# EAGLE design minimumSystem_Gustina diah (EAGLE 7.1.0)
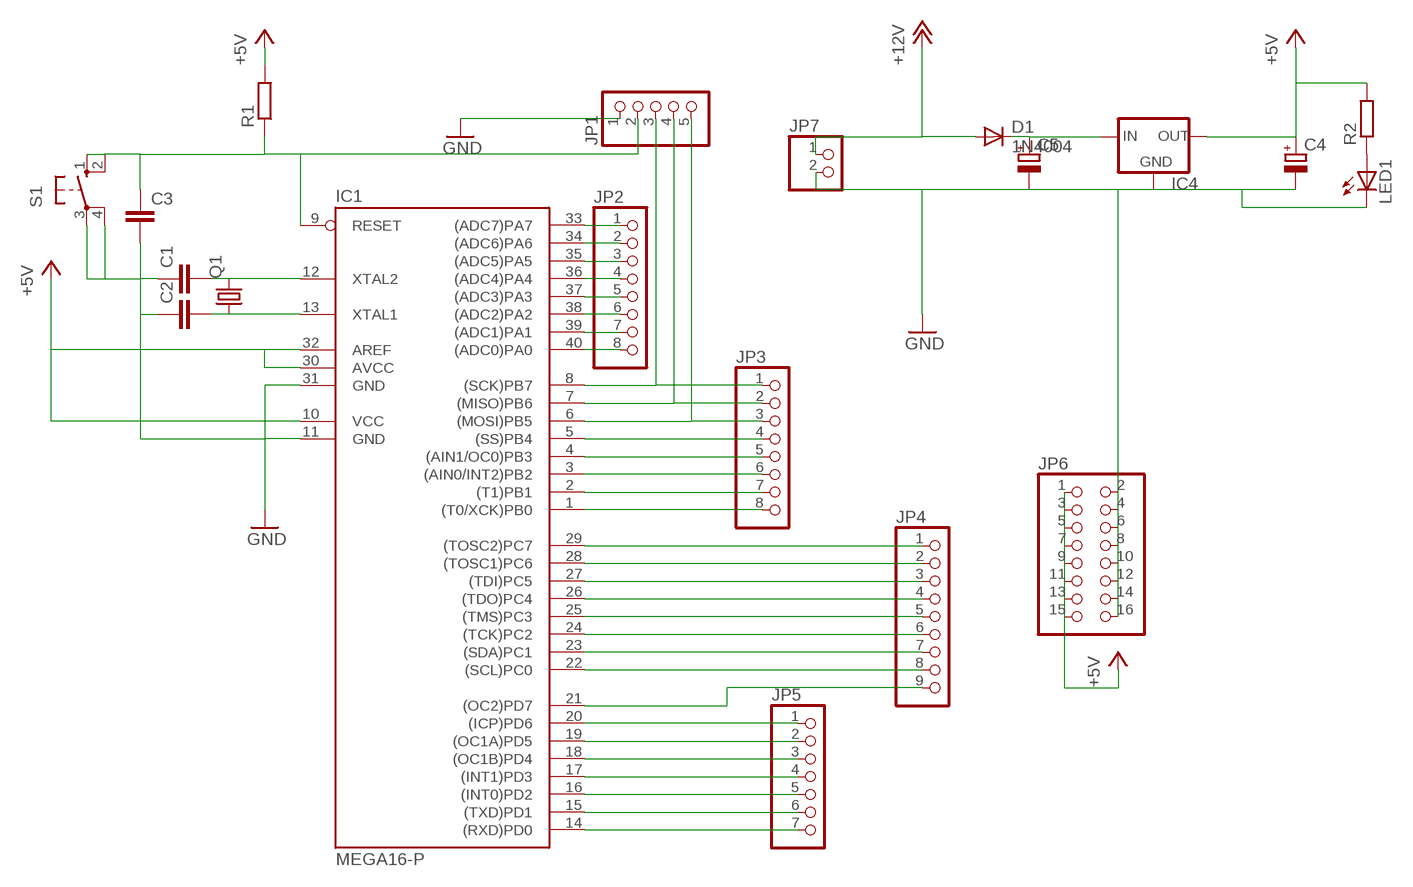
[diagram p0: schematic, sheet 1]

## Parts
C1  C-EU025-024X044  [C025-024X044]
C2  C-EU025-024X044  [C025-024X044]
C3  C-EU050-025X075  [C050-025X075]
C4  CPOL-EUE2.5-5  [E2,5-5]
C5  CPOL-EUE2.5-5  [E2,5-5]
D1  1N4004  [DO41-10]
IC1  MEGA16-P  [DIL40]
IC4  78XXS  [78XXS]
JP1  PINHD-1X5  [1X05]
JP2  PINHD-1X8  [1X08]
JP3  PINHD-1X8  [1X08]
JP4  PINHD-1X9  [1X09]
JP5  PINHD-1X7  [1X07]
JP6  PINHD-2X8  [2X08]
JP7  PINHD-1X2  [1X02]
LED1  LED5MM  [LED5MM]
Q1  CRYSTALHC49U-V  [HC49U-V]
R1  R-EU_0204/7  [0204/7]
R2  R-EU_0204/7  [0204/7]
S1  10-XX  [B3F-10XX]

## Nets
+5V: C4.+ IC1.10(VCC) IC1.30(AVCC) IC1.32(AREF) IC4.OUT JP6.1 JP6.3 JP6.5 JP6.7 JP6.9 JP6.11 JP6.13 JP6.15 R1.2 R2.2
+12V: D1.A JP7.1
C0: IC1.22((SCL)PC0) JP4.8
C1: IC1.23((SDA)PC1) JP4.7
C2: IC1.24((TCK)PC2) JP4.6
C3: IC1.25((TMS)PC3) JP4.5
D7: IC1.14((RXD)PD0) JP5.7
GND: C1.1 C2.1 C3.2 C4.- C5.- IC1.11(GND) IC1.31(GND) IC4.GND JP1.1 JP6.2 JP6.4 JP6.6 JP6.8 JP6.10 JP6.12 JP6.14 JP6.16 JP7.2 LED1.K(C) S1.3(P) S1.4(P1)
N$1: IC1.33((ADC7)PA7) JP2.1
N$2: IC1.34((ADC6)PA6) JP2.2
N$3: IC1.35((ADC5)PA5) JP2.3
N$4: IC1.36((ADC4)PA4) JP2.4
N$5: IC1.37((ADC3)PA3) JP2.5
N$6: IC1.38((ADC2)PA2) JP2.6
N$7: IC1.39((ADC1)PA1) JP2.7
N$8: IC1.40((ADC0)PA0) JP2.8
N$11: IC1.29((TOSC2)PC7) JP4.1
N$12: IC1.28((TOSC1)PC6) JP4.2
N$13: IC1.27((TDI)PC5) JP4.3
N$14: IC1.5((SS)PB4) JP3.4
N$15: IC1.20((ICP)PD6) JP5.1
N$16: IC1.19((OC1A)PD5) JP5.2
N$19: IC1.26((TDO)PC4) JP4.4
N$20: IC1.6((MOSI)PB5) JP1.5 JP3.3
N$21: IC1.4((AIN1/OC0)PB3) JP3.5
N$22: IC1.3((AIN0/INT2)PB2) JP3.6
N$23: IC1.2((T1)PB1) JP3.7
N$24: IC1.1((T0/XCK)PB0) JP3.8
N$25: C5.+ D1.C IC4.IN
N$30: IC1.15((TXD)PD1) JP5.6
N$31: IC1.16((INT0)PD2) JP5.5
N$32: IC1.17((INT1)PD3) JP5.4
N$33: C3.1 IC1.9(RESET) JP1.2 R1.1 S1.1(S) S1.2(S1)
N$34: IC1.18((OC1B)PD4) JP5.3
N$35: C1.2 IC1.12(XTAL2) Q1.2
N$36: C2.2 IC1.13(XTAL1) Q1.1
N$37: LED1.A R2.1
N$46: IC1.8((SCK)PB7) JP1.3 JP3.1
N$47: IC1.7((MISO)PB6) JP1.4 JP3.2
RS: IC1.21((OC2)PD7) JP4.9

## Library data of the parts
C1 C2 = rcl:C-EU: CAPACITOR, European symbol
C3 = resistor:C-EU: CAPACITOR, European symbol
C4 C5 = rcl:CPOL-EU: POLARIZED CAPACITOR, European symbol
D1 = diode:1N4004: DIODE general purpose rectifier, 1 A
IC1 = atmel:MEGA16-P: MICROCONTROLLER 16 Kbytes FLASH 1 kbytes SRAM 512 bytes EEPROM USART 8-channel 10 bit ADC Source: avr.lbr; MPN: ATMEGA16-16PU; OC_FARNELL: 9171142; OC_NEWARK: 01M6885
IC4 = v-reg:78XXS: VOLTAGE REGULATOR
JP1 = pinhead:PINHD-1X5: PIN HEADER
JP2 JP3 = pinhead:PINHD-1X8: PIN HEADER
JP4 = pinhead:PINHD-1X9: PIN HEADER
JP5 = pinhead:PINHD-1X7: PIN HEADER
JP6 = pinhead:PINHD-2X8: PIN HEADER
JP7 = pinhead:PINHD-1X2: PIN HEADER
LED1 = led:LED: LED OSRAM: - CHIPLED LG R971, LG N971, LY N971, LG Q971, LY Q971, LO R971, LY R971 LH N974, LH R974 LS Q976, LO Q976, LY Q976 LO Q996 - Hyper CHIPLED LW Q18S LB Q993, LB Q99A, LB R99A - SideLED LS A670, LO A670, LY A670, LG A670, LP A670 LB A673, LV A673, LT A673, LW A673 LH A674 LY A675 LS A676, LA A676, LO A676, LY A676, LW A676 LS A679, LY A679, LG A679 - Hyper Micro SIDELED® LS Y876, LA Y876, LO Y876, LY Y876 LT Y87S - SmartLED LW L88C, LW L88S LB L89C, LB L89S, LG L890 LS L89K, LO L89K, LY L89K LS L896, LA L896, LO L896, LY L896 - TOPLED LS T670, LO T670, LY T670, LG T670, LP T670 LSG T670, LSP T670, LSY T670, LOP T670, LYG T670 LG T671, LOG T671, LSG T671 LB T673, LV T673, LT T673, LW T673 LH T674 LS T676, LA T676, LO T676, LY T676, LB T676, LH T676, LSB T676, LW T676 LB T67C, LV T67C, LT T67C, LS T67K, LO T67K, LY T67K, LW E67C LS E67B, LA E67B, LO E67B, LY E67B, LB E67C, LV E67C, LT E67C LW T67C LS T679, LY T679, LG T679 LS T770, LO T770, LY T770, LG T770, LP T770 LB T773, LV T773, LT T773, LW T773 LH T774 LS E675, LA E675, LY E675, LS T675 LS T776, LA T776, LO T776, LY T776, LB T776 LHGB T686 LT T68C, LB T68C - Hyper Mini TOPLED® LB M676 - Mini TOPLED Santana® LG M470 LS M47K, LO M47K, LY M47K Source: http://www.osram.convergy.de LUXEON: - LUMILED® LXK2-PW12-R00, LXK2-PW12-S00, LXK2-PW14-U00, LXK2-PW14-V00 LXK2-PM12-R00, LXK2-PM12-S00, LXK2-PM14-U00 LXK2-PE12-Q00, LXK2-PE12-R00, LXK2-PE12-S00, LXK2-PE14-T00, LXK2-PE14-U00 LXK2-PB12-K00, LXK2-PB12-L00, LXK2-PB12-M00, LXK2-PB14-N00, LXK2-PB14-P00, LXK2-PB14-Q00 LXK2-PR12-L00, LXK2-PR12-M00, LXK2-PR14-Q00, LXK2-PR14-R00 LXK2-PD12-Q00, LXK2-PD12-R00, LXK2-PD12-S00 LXK2-PH12-R00, LXK2-PH12-S00 LXK2-PL12-P00, LXK2-PL12-Q00, LXK2-PL12-R00 Source: www.luxeon.com KINGBRIGHT: KA-3528ASYC Source: www.kingbright.com
Q1 = crystal:CRYSTAL: CRYSTAL; OC_FARNELL: 1666969; OC_NEWARK: unknown
R1 R2 = rcl:R-EU_: RESISTOR, European symbol
S1 = switch-omron:10-XX: OMRON SWITCH; MPN: B3F-1000; OC_FARNELL: 176432; OC_NEWARK: 36M3542

## Board
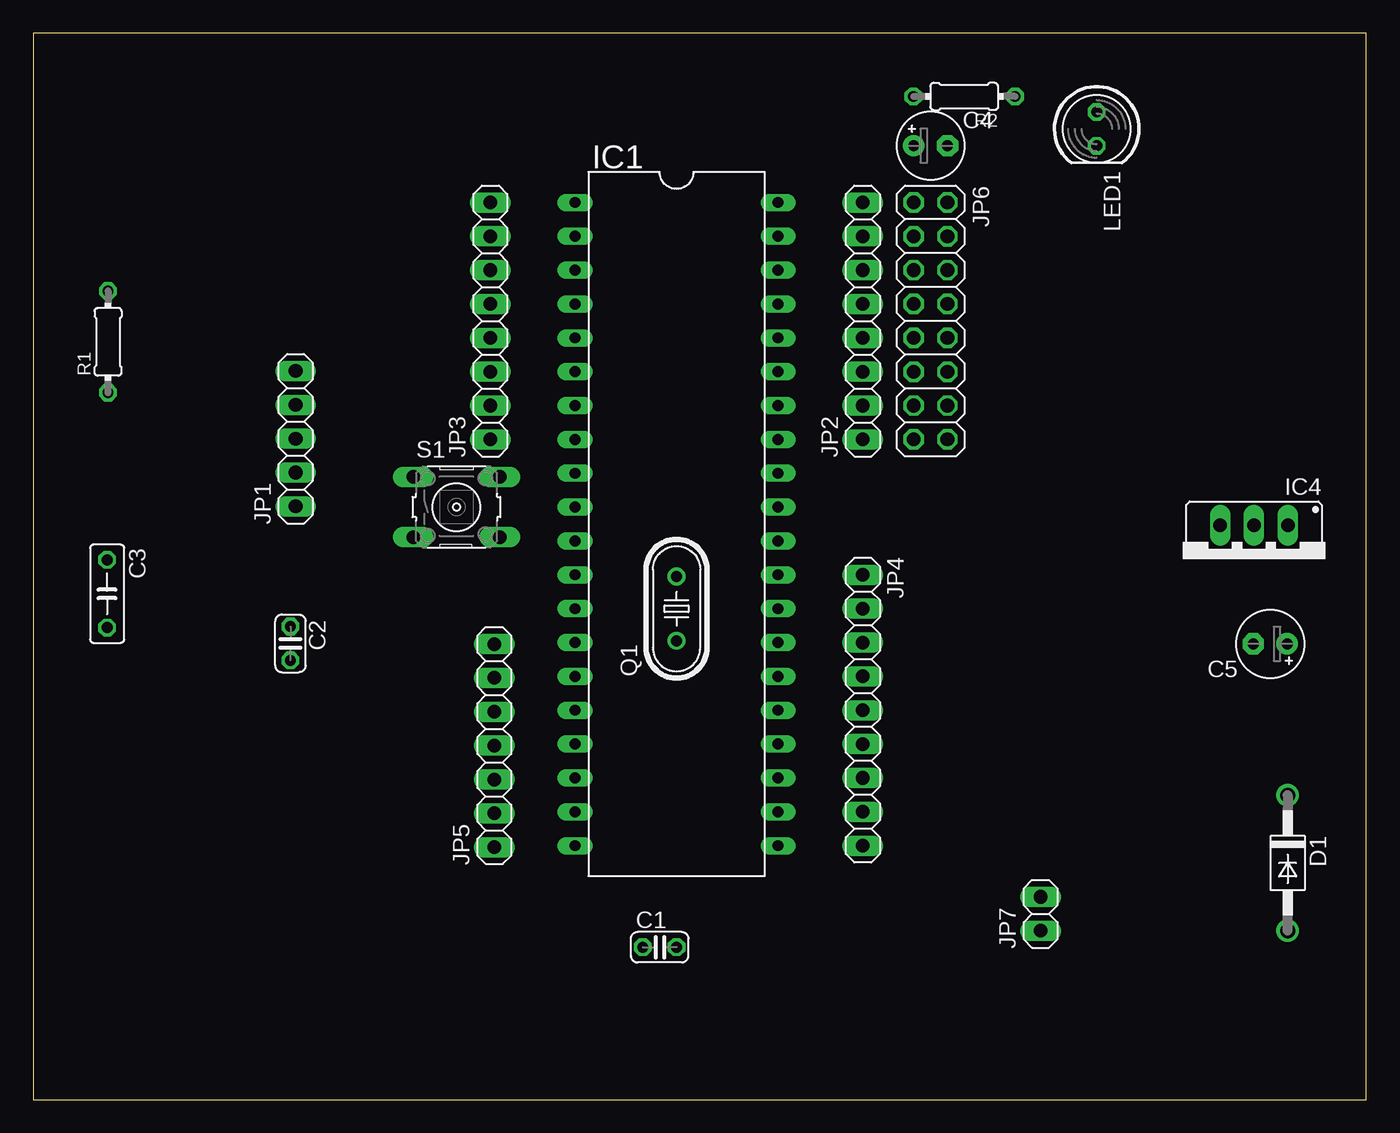
[diagram p1: board, top side]
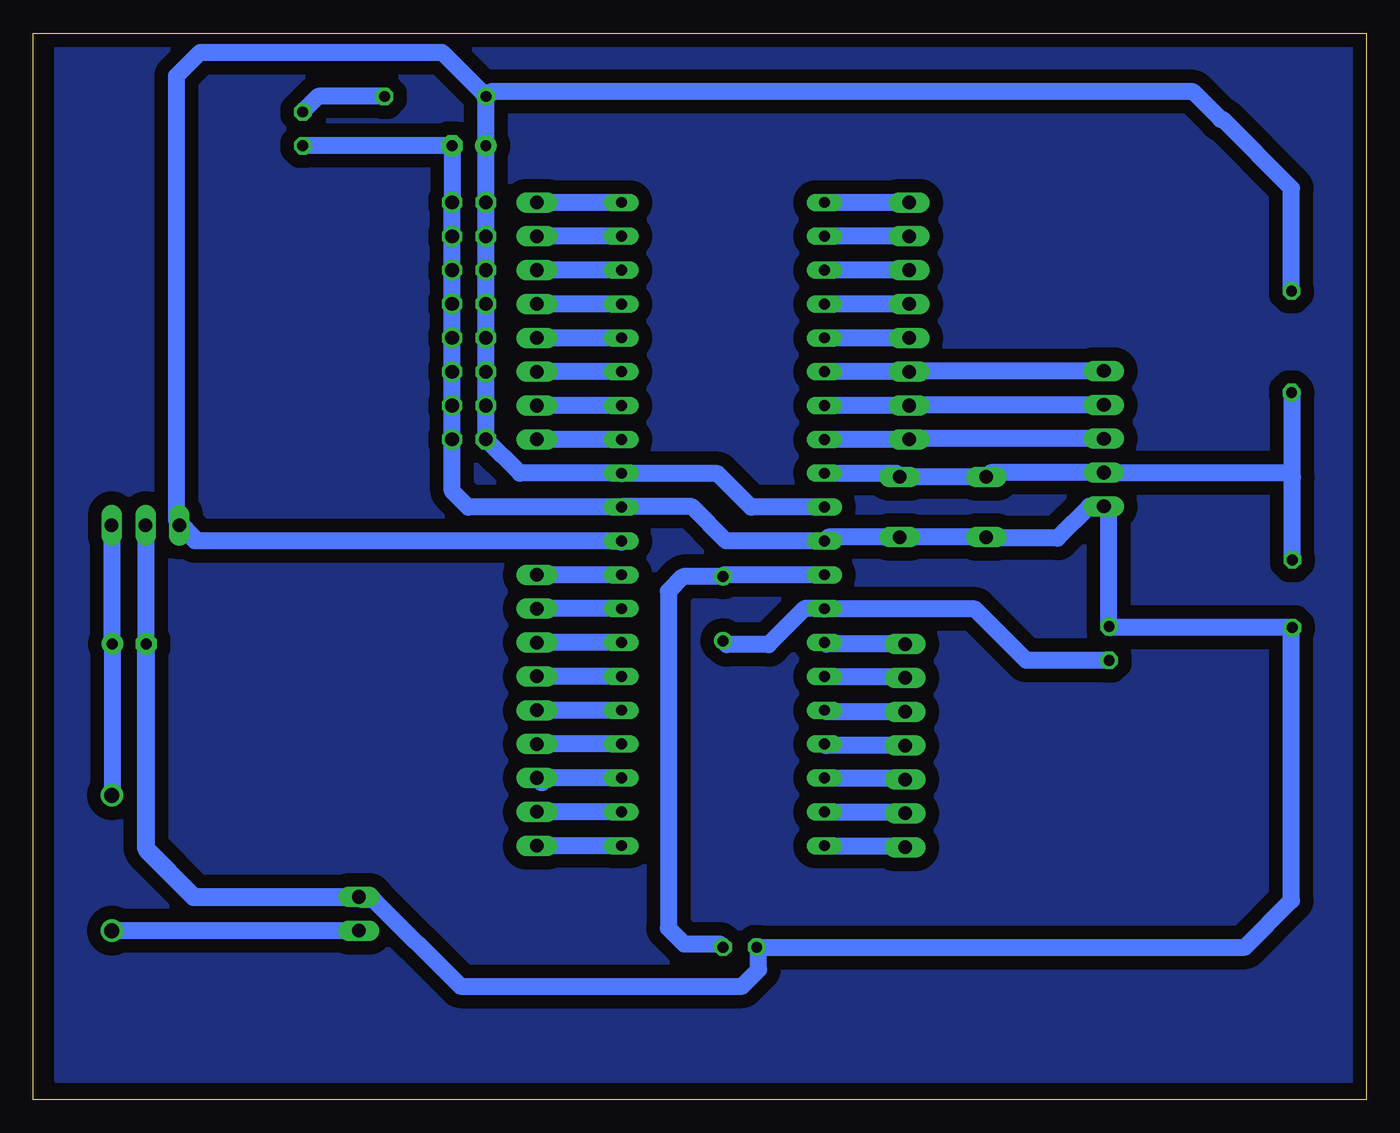
[diagram p2: board, bottom side, seen from below]

Size 100 x 80 mm. Coordinates in mm from the lower left corner, seen from the top.
Outline: 0,0 100,0 100,80 0,80 0,0
Copper layers (1*16): Top 0.035mm / dielectric 1.5mm / Bottom 0.035mm
Design rules "default": minimum track width 10mil, minimum drill 24mil, track to track 8mil, track to pad 8mil, pad to pad 8mil, via to via 8mil, smd to smd 8mil, copper to edge 40mil, drill to drill 8mil, minimum pad ring 10mil, minimum via ring 8mil, stop-mask expansion 4mil, vias tented up to drill 0mil, thermal gap 10mil

### Footprints (pad centres in the part's own frame; a part is rotated, then mirrored left to right if it is on the bottom)
C025-024X044 = drill 0.813 octagon: 1 -1.27,0; 2 1.27,0
C050-025X075 = drill 0.813 octagon: 1 -2.54,0; 2 2.54,0
E2,5-5 = drill 0.813 pad 1.6: + -1.27,0 | drill 0.813 pad 1.6 octagon: - 1.27,0
DO41-10 = drill 1.118: A 5.08,0; C -5.08,0
DIL40 = drill 0.813 long: 1 -24.13,-7.62; 2 -21.59,-7.62; 3 -19.05,-7.62; 4 -16.51,-7.62; 5 -13.97,-7.62; 6 -11.43,-7.62; 7 -8.89,-7.62; 8 -6.35,-7.62; 9 -3.81,-7.62; 10 -1.27,-7.62; 11 1.27,-7.62; 12 3.81,-7.62; 13 6.35,-7.62; 14 8.89,-7.62; 15 11.43,-7.62; 16 13.97,-7.62; 17 16.51,-7.62; 18 19.05,-7.62; 19 21.59,-7.62; 20 24.13,-7.62; 21 24.13,7.62; 22 21.59,7.62; 23 19.05,7.62; 24 16.51,7.62; 25 13.97,7.62; 26 11.43,7.62; 27 8.89,7.62; 28 6.35,7.62; 29 3.81,7.62; 30 1.27,7.62; 31 -1.27,7.62; 32 -3.81,7.62; 33 -6.35,7.62; 34 -8.89,7.62; 35 -11.43,7.62; 36 -13.97,7.62; 37 -16.51,7.62; 38 -19.05,7.62; 39 -21.59,7.62; 40 -24.13,7.62
78XXS = drill 1.016 long: GND 0,-2.54; IN -2.54,-2.54; OUT 2.54,-2.54
1X05 = drill 1.016 long: 1 -5.08,0; 2 -2.54,0; 3 0,0; 4 2.54,0; 5 5.08,0
1X08 = drill 1.016 long: 1 -8.89,0; 2 -6.35,0; 3 -3.81,0; 4 -1.27,0; 5 1.27,0; 6 3.81,0; 7 6.35,0; 8 8.89,0
1X09 = drill 1.016 long: 1 -10.16,0; 2 -7.62,0; 3 -5.08,0; 4 -2.54,0; 5 0,0; 6 2.54,0; 7 5.08,0; 8 7.62,0; 9 10.16,0
1X07 = drill 1.016 long: 1 -7.62,0; 2 -5.08,0; 3 -2.54,0; 4 0,0; 5 2.54,0; 6 5.08,0; 7 7.62,0
2X08 = drill 1.016 octagon: 1 -8.89,-1.27; 2 -8.89,1.27; 3 -6.35,-1.27; 4 -6.35,1.27; 5 -3.81,-1.27; 6 -3.81,1.27; 7 -1.27,-1.27; 8 -1.27,1.27; 9 1.27,-1.27; 10 1.27,1.27; 11 3.81,-1.27; 12 3.81,1.27; 13 6.35,-1.27; 14 6.35,1.27; 15 8.89,-1.27; 16 8.89,1.27
1X02 = drill 1.016 long: 1 -1.27,0; 2 1.27,0
LED5MM = drill 0.813 octagon: A -1.27,0; K 1.27,0
HC49U-V = drill 0.813: 1 -2.413,0; 2 2.413,0
0204/7 = drill 0.813 octagon: 1 -3.81,0; 2 3.81,0
B3F-10XX = drill 1.016 long: 1 -3.251,2.261; 2 3.251,2.261; 3 -3.251,-2.261; 4 3.251,-2.261

### Placement (x,y rotation side)
C1  46.99,11.43 0 top
C2  19.29,34.22 270 top
C3  5.54,37.95 270 top
C4  67.32,71.57 0 top
C5  92.8,34.19 180 top
D1  94.11,17.75 270 top
IC1  48.26,43.18 270 top
IC4  91.58,40.56 180 top
JP1  19.68,49.58 90 top
JP2  62.23,58.42 90 top
JP3  34.29,58.42 90 top
JP4  62.23,29.21 270 top
JP5  34.58,26.55 90 top
JP6  67.31,58.42 270 top
JP7  75.57,13.94 90 top
LED1  79.78,72.83 270 top
Q1  48.26,36.83 90 top
R1  5.61,56.85 90 top
R2  69.84,75.26 180 top
S1  31.75,44.45 0 top

### Tracks (layer width: path | path; a pad name or v marks a point on that pad's centre or on a via)
+5V
  Bottom 1.27: IC1.30 55.88,41.81 | IC1.30 87.86,41.91 IC4.OUT | IC1.10 46.15,44.45 48.66,46.96 55.85,46.96 IC1.32 63.5,46.99 JP6.15 JP6.13 JP6.11 JP6.9 JP6.7 JP6.5 JP6.3 JP6.1 66.04,71.56 C4.+ 66.05,75.25 R2.2 | R1.2 5.61,68.38 10.77,73.54 10.91,73.54 12.98,75.61 65.68,75.61 R2.2 | IC1.30 87.65,41.91 89.25,43.51 89.25,76.81 87.48,78.58 69.34,78.58 R2.2
+12V
  Bottom 1.27: JP7.1 D1.A
C0
  Bottom 1.27: IC1.22 JP4.8
C1
  Bottom 1.27: IC1.23 61.46,24.13 61.8,23.79 61.89,23.79 JP4.7
C2
  Bottom 1.27: IC1.24 JP4.6
C3
  Bottom 1.27: IC1.25 JP4.5
D7
  Bottom 1.27: JP5.7 40.52,34.17 IC1.14
GND
  Bottom 1.27: JP7.2 87.88,15.21 91.59,18.91 91.59,34.13 C5.- | C5.- 91.53,43.04 IC4.GND | LED1.K C4.- JP6.2 JP6.4 JP6.6 JP6.8 JP6.10 JP6.12 JP6.14 JP6.16 68.58,45.66 67.37,44.45 IC1.31 55.85,44.48 50.59,44.48 48.02,41.91 IC1.11 40.36,42.19 S1.4 S1.3 28.43,42.12 23.16,42.12 20.77,44.5 JP1.1 19.29,44.11 C2.1 19.21,35.41 C3.2 5.6,35.34 5.6,14.93 9.1,11.43 C1.1 45.59,11.3 45.59,9.74 46.83,8.5 67.96,8.5 74.49,15.04 75.46,15.04 75.58,15.16 87.99,15.16 91.53,18.7 C5.-
N$1
  Bottom 1.27: IC1.33 55.33,49.53 55.31,49.51 62.21,49.51 JP2.1
N$2
  Bottom 1.27: IC1.34 JP2.2
N$3
  Bottom 1.27: IC1.35 JP2.3
N$4
  Bottom 1.27: IC1.36 JP2.4
N$5
  Bottom 1.27: IC1.37 JP2.5
N$6
  Bottom 1.27: IC1.38 JP2.6
N$7
  Bottom 1.27: IC1.39 JP2.7
N$8
  Bottom 1.27: IC1.40 JP2.8
N$9
  pour Bottom (isolate 1.016): 0.8,79.61 0.8,1.44 98.24,1.44 98.24,79.61 0.8,79.61 0.8,79.57
N$11
  Bottom 1.27: IC1.29 JP4.1
N$12
  Bottom 1.27: IC1.28 JP4.2
N$13
  Bottom 1.27: IC1.27 JP4.3
N$14
  Bottom 1.27: JP3.4 IC1.5
N$15
  Bottom 1.27: IC1.20 34.7,19.05 JP5.1
N$16
  Bottom 1.27: IC1.19 34.7,21.59 JP5.2
N$19
  Bottom 1.27: IC1.26 JP4.4
N$20
  Bottom 1.27: JP3.3 34.81,54.61 | 34.81,54.61 IC1.6 | JP1.5 34.75,54.66 34.81,54.61
N$21
  Bottom 1.27: JP3.5 IC1.4
N$22
  Bottom 1.27: JP3.6 IC1.3
N$23
  Bottom 1.27: JP3.7 IC1.2
N$24
  Bottom 1.27: JP3.8 IC1.1
N$25
  Bottom 1.27: D1.C 94.07,22.87 C5.+ 94.07,43.04 IC4.IN
N$30
  Bottom 1.27: IC1.15 34.7,31.75 JP5.6
N$31
  Bottom 1.27: JP5.5 40.52,29.09 IC1.16
N$32
  Bottom 1.27: JP5.4 40.52,26.55 IC1.17
N$33
  Bottom 1.27: IC1.9 35.28,46.99 S1.2 S1.1 28.17,47.04 JP1.2 5.88,47.04 5.54,46.7 | C3.1 5.54,46.7 | 5.54,46.7 5.54,52.97 R1.1
N$34
  Bottom 1.27: IC1.18 34.7,24.13 JP5.3
N$35
  Bottom 1.27: IC1.12 48.13,39.37 Q1.2 51.24,39.24 52.36,38.13 52.36,12.86 51.18,11.67 48.5,11.67 C1.2
N$36
  Bottom 1.27: C2.2 25.5,32.95 29.35,36.8 40.61,36.8 IC1.13 42.14,36.83 44.84,34.14 47.98,34.14 Q1.1
N$37
  Bottom 1.27: R2.1 78.62,75.26 LED1.A
N$46
  Bottom 1.27: IC1.8 JP3.1 34.24,49.58 JP1.3
N$47
  Bottom 1.27: JP3.2 34.81,52.07 | 34.81,52.07 IC1.7 | JP1.4 34.75,52.12 34.81,52.07
RS
  Bottom 1.27: IC1.21 JP4.9